# EAGLE design powerCard_rev0.1 (EAGLE 9.4.2)
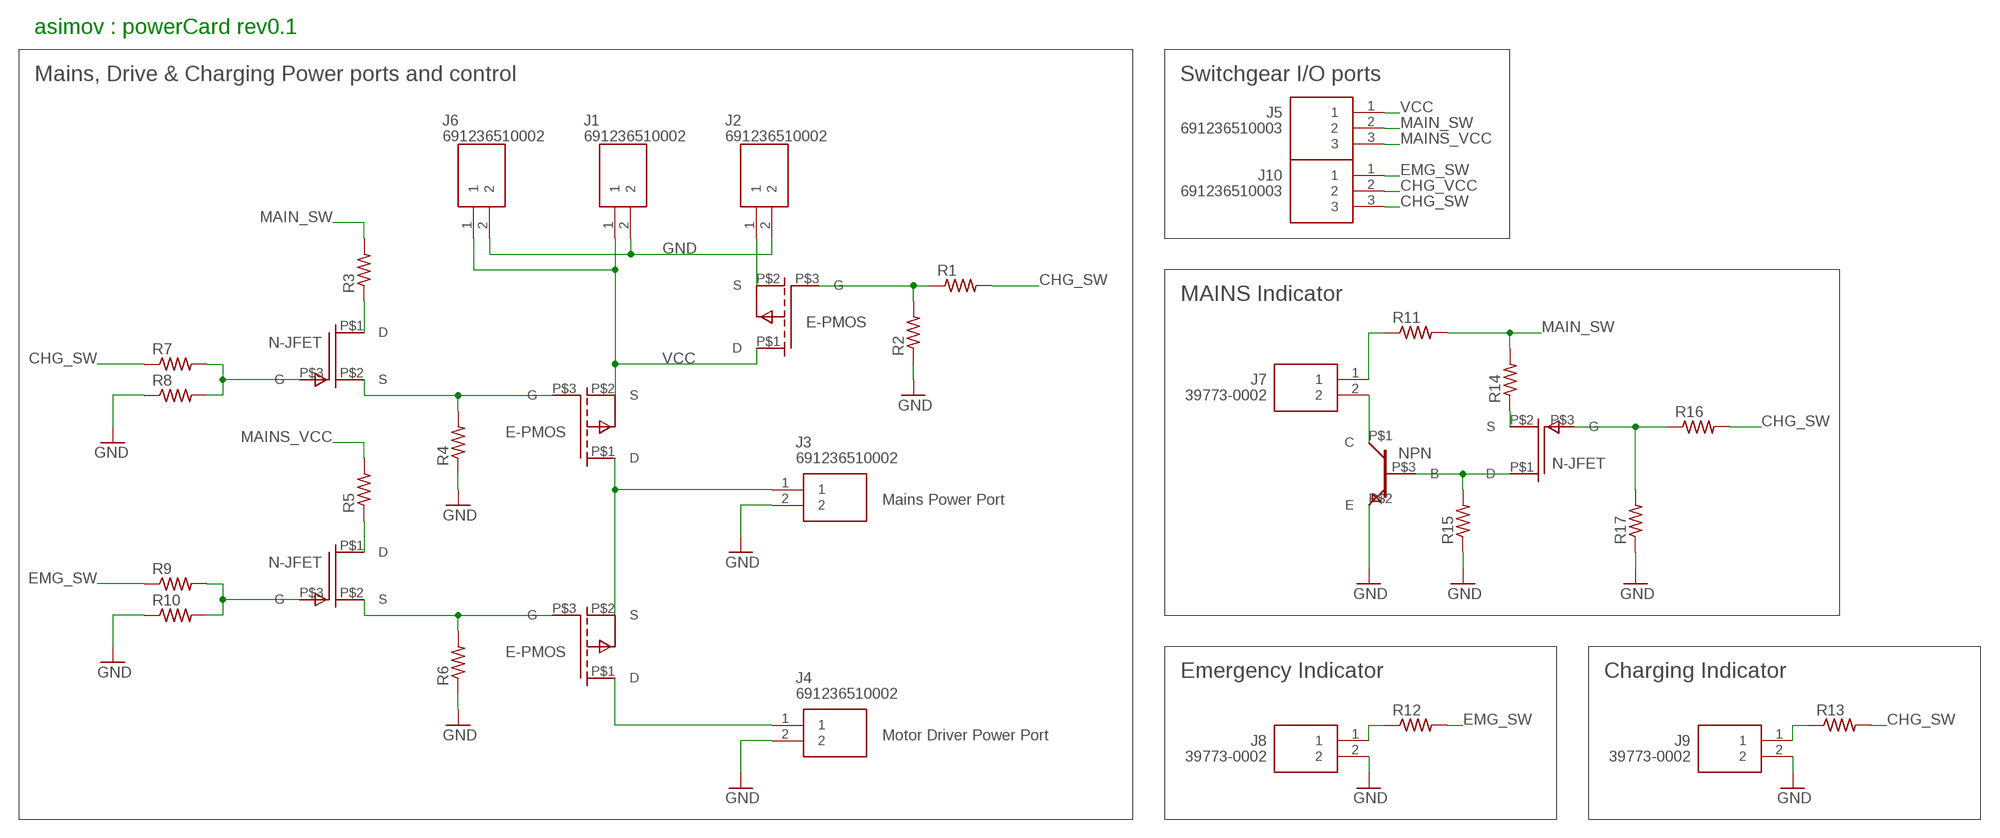
[diagram p0: schematic, sheet 1]

## Parts
J1  691236510002  [SHDR2W90P0X508_1X2_1076X1135X1]
J2  691236510002  [SHDR2W90P0X508_1X2_1076X1135X1]
J3  691236510002  [SHDR2W90P0X508_1X2_1076X1135X1]
J4  691236510002  [SHDR2W90P0X508_1X2_1076X1135X1]
J5  691236510003  [SHDR3W90P0X508_1X3_1524X1135X1]
J6  691236510002  [SHDR2W90P0X508_1X2_1076X1135X1]
J7  39773-0002  [SHDR2W110P0X254_1X2_554X650X10]
J8  39773-0002  [SHDR2W110P0X254_1X2_554X650X10]
J9  39773-0002  [SHDR2W110P0X254_1X2_554X650X10]
J10  691236510003  [SHDR3W90P0X508_1X3_1524X1135X1]
R1  R-US_0204/7  [0204/7]
R2  R-US_0204/7  [0204/7]
R3  R-US_0204/7  [0204/7]
R4  R-US_0204/7  [0204/7]
R5  R-US_0204/7  [0204/7]
R6  R-US_0204/7  [0204/7]
R7  R-US_0204/7  [0204/7]
R8  R-US_0204/7  [0204/7]
R9  R-US_0204/7  [0204/7]
R10  R-US_0204/7  [0204/7]
R11  R-US_0204/7  [0204/7]
R12  R-US_0204/7  [0204/7]
R13  R-US_0204/7  [0204/7]
R14  R-US_0204/7  [0204/7]
R15  R-US_0204/7  [0204/7]
R16  R-US_0204/7  [0204/7]
R17  R-US_0204/7  [0204/7]
U$1  E-PMOSFET  [TO-220]
U$2  E-PMOSFET  [TO-220]
U$3  E-PMOSFET  [TO-220]
U$4  N-JFET  [TO-92(3L)]
U$5  N-JFET  [TO-92(3L)]
U$6  NPN-BJT  [TO-92]
U$7  N-JFET  [TO-92(3L)]

## Nets
CHG_GATE: R1.1 R2.2 U$1.P$3(G)
CHG_SW: J10.3 R1.2 R7.1 R13.2 R16.2
CHG_VCC: J2.1 J10.2 U$1.P$2(S)
EMG_GATE: R6.2 U$3.P$3(G) U$5.P$2(S)
EMG_SW: J10.1 R9.1 R12.2
GND: J1.2 J2.2 J3.2 J4.2 J6.2 J8.2 J9.2 R2.1 R4.1 R6.1 R8.1 R10.1 R15.1 R17.1 U$6.P$2(E)
MAIN_SW: J5.2 R3.2 R11.2 R14.2
MAINS_GATE: R4.2 U$2.P$3(G) U$4.P$2(S)
MAINS_IND_BASE: R15.2 U$6.P$3(B) U$7.P$1(D)
MAINS_IND_GATE: R16.1 R17.2 U$7.P$3(G)
MAINS_VCC: J3.1 J5.3 R5.2 U$2.P$1(D) U$3.P$2(S)
MD_VCC: J4.1 U$3.P$1(D)
N$1: R3.1 U$4.P$1(D)
N$2: R7.2 R8.2 U$4.P$3(G)
N$3: R9.2 R10.2 U$5.P$3(G)
N$4: J7.1 R11.1
N$5: R5.1 U$5.P$1(D)
N$6: J8.1 R12.1
N$7: J9.1 R13.1
N$8: J7.2 U$6.P$1(C)
N$11: R14.1 U$7.P$2(S)
VCC: J1.1 J5.1 J6.1 U$1.P$1(D) U$2.P$2(S)

## Notes on the sheet
- asimov : powerCard rev0.1
- Mains, Drive & Charging Power ports and control | Switchgear I/O ports
- MAINS Indicator
- Mains Power Port
- Emergency Indicator | Charging Indicator
- Motor Driver Power Port

## Library data of the parts
J1-J4 J6 = 691236510002:691236510002: Fixed Terminal Blocks WR-TBL 2365 Hztl 5.08mm Risng clamp Source: Datasheet <https://katalog.we-online.de/en/em/TBL_5_08_2365_HORIZONTAL_ENTRY_W_RISING_CAGE_CLAMP_6912365100xx>; DESCRIPTION: Fixed Terminal Blocks WR-TBL 2365 Hztl 5.08mm Risng clamp; HEIGHT: 18.1mm; MANUFACTURER_NAME: Wurth Elektronik; MANUFACTURER_PART_NUMBER: 691236510002; MOUSER_PART_NUMBER: 710-691236510002; MOUSER_PRICE-STOCK: https://www.mouser.com/Search/Refine.aspx?Keyword=710-691236510002
J5 J10 = 691236510003:691236510003: Fixed Terminal Blocks WR-TBL 2365 Hztl 5.08mm Risng clamp Source: Datasheet <https://katalog.we-online.de/em/datasheet/691236510003.pdf>; DESCRIPTION: Fixed Terminal Blocks WR-TBL 2365 Hztl 5.08mm Risng clamp; HEIGHT: 18.1mm; MANUFACTURER_NAME: Wurth Elektronik; MANUFACTURER_PART_NUMBER: 691236510003; MOUSER_PART_NUMBER: 710-691236510003; MOUSER_PRICE-STOCK: https://www.mouser.com/Search/Refine.aspx?Keyword=710-691236510003
J7-J9 = 39773-0002:39773-0002: Fixed Terminal Blocks 2.54mm Eurostyle Fxd TB Mnt PCB 2Ckt Grn Source: Datasheet <https://www.molex.com/pdm_docs/sd/397730002_sd.pdf>; DESCRIPTION: Fixed Terminal Blocks 2.54mm Eurostyle Fxd TB Mnt PCB 2Ckt Grn; HEIGHT: 10mm; MANUFACTURER_NAME: Molex; MANUFACTURER_PART_NUMBER: 39773-0002; MOUSER_PART_NUMBER: 538-39773-0002; MOUSER_PRICE-STOCK: https://www.mouser.com/Search/Refine.aspx?Keyword=538-39773-0002
R1-R17 = rcl:R-US_: RESISTOR, American symbol; SPICEPREFIX: R
U$1-U$3 = transistors:E-PMOSFET: Enhancement type P-Channel MOSFET > Normally Open. > Apply -VGS to connect.
U$4 U$5 U$7 = transistors:N-JFET: N-Channel JFET > Normally Closed. > Apply -VGS to disconnect.
U$6 = transistors:NPN-BJT: NPN BJT > Normally Open. > Apply +VBE to connect.

## Board
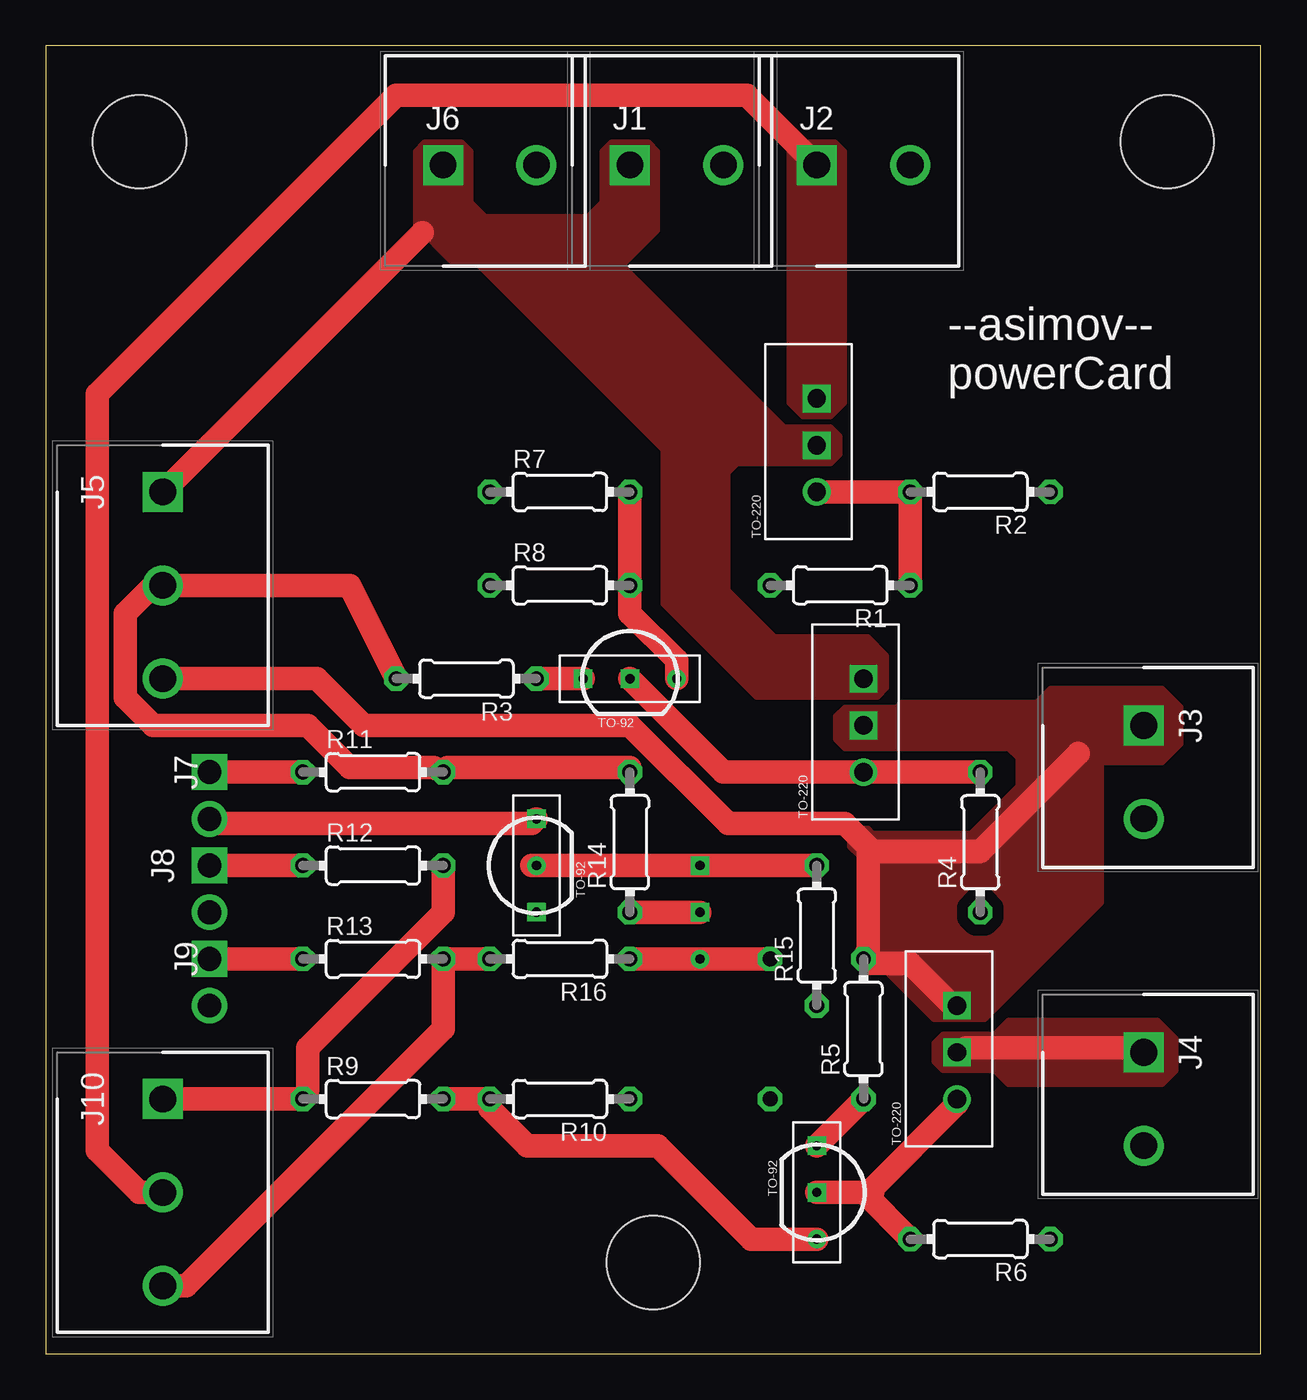
[diagram p1: board, top side]
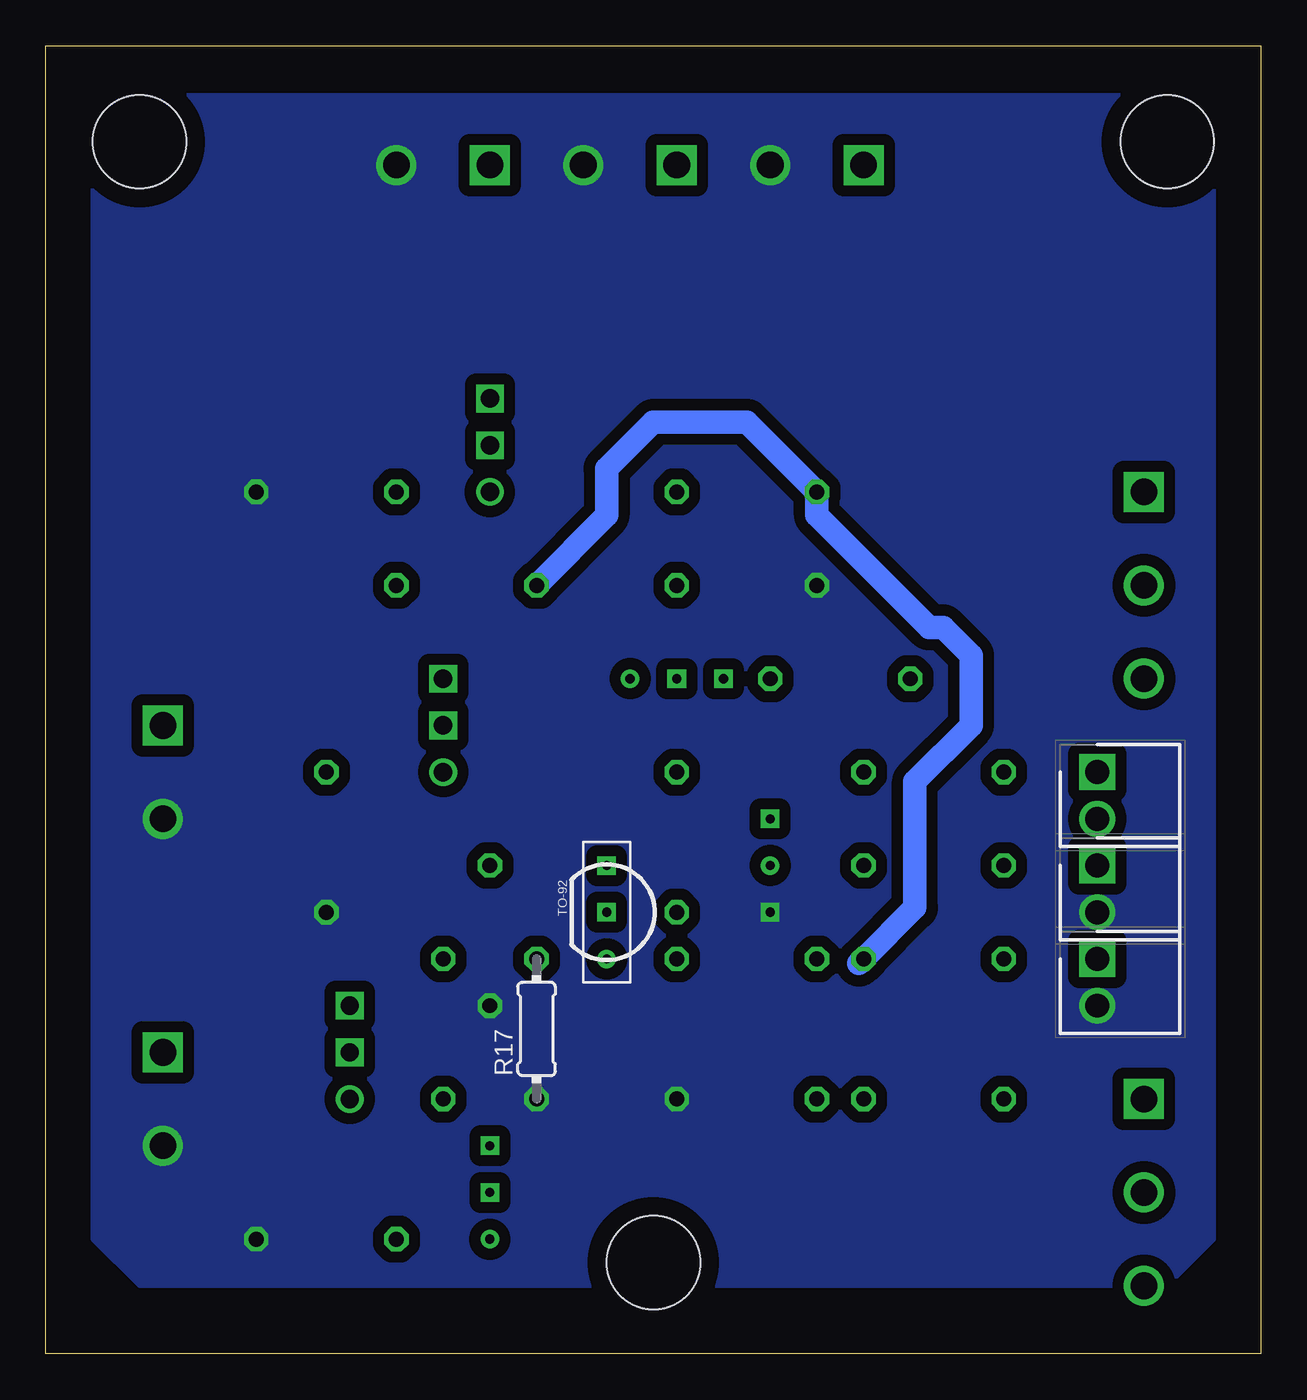
[diagram p2: board, bottom side, seen from below]

Size 66.05 x 71.12 mm. Coordinates in mm from the lower left corner, seen from the top.
Outline: 0,0 66.05,0 66.05,71.12 0,71.12 0,0
Copper layers (1*16): Top 0.035mm / dielectric 1.5mm / Bottom 0.035mm
Design rules "default *": minimum track width 50mil, minimum drill 50mil, track to track 10mil, track to pad 10mil, pad to pad 10mil, via to via 10mil, smd to smd 6mil, copper to edge 40mil, drill to drill 6mil, minimum pad ring 10mil, minimum via ring 8mil, stop-mask expansion 4mil, vias tented up to drill 0mil, thermal gap 10mil
Holes 5.08 mm at 5.08,65.91 60.96,65.91 33.02,4.95

### Footprints (pad centres in the part's own frame; a part is rotated, then mirrored left to right if it is on the bottom)
SHDR2W90P0X508_1X2_1076X1135X1 = drill 1.45 pad 2.175 square: 1 0,0 | drill 1.45 pad 2.175: 2 5.08,0
SHDR3W90P0X508_1X3_1524X1135X1 = drill 1.45 pad 2.175 square: 1 0,0 | drill 1.45 pad 2.175: 2 5.08,0; 3 10.16,0
SHDR2W110P0X254_1X2_554X650X10 = drill 1.3 pad 1.95 square: 1 0,0 | drill 1.3 pad 1.95: 2 2.54,0
0204/7 = drill 0.813 octagon: 1 -3.81,0; 2 3.81,0
TO-220 = drill 1 square: P$1 0,0; P$2 2.54,0 | drill 1: P$3 -2.54,0
TO-92(3L) = drill 0.5 square: P$1 -2.54,0; P$2 0,0 | drill 0.5: P$3 2.54,0
TO-92 = drill 0.5 square: P$1 2.54,0; P$2 -2.54,0 | drill 0.5: P$3 0,0

### Placement (x,y rotation side)
J1  31.75,64.64 0 top
J2  41.91,64.64 0 top
J3  59.69,34.16 270 top
J4  59.69,16.38 270 top
J5  6.35,46.86 270 top
J6  21.59,64.64 0 top
J7  8.89,31.62 270 bottom
J8  8.89,26.54 270 bottom
J9  8.89,21.46 270 bottom
J10  6.35,13.84 270 top
R1  43.18,41.78 180 top
R2  50.8,46.86 180 top
R3  22.86,36.7 180 top
R4  50.8,27.81 90 top
R5  44.45,17.65 90 top
R6  50.8,6.22 180 top
R7  27.94,46.86 0 top
R8  27.94,41.78 0 top
R9  17.78,13.84 0 top
R10  27.94,13.84 180 top
R11  17.78,31.62 0 top
R12  17.78,26.54 0 top
R13  17.78,21.46 0 top
R14  31.75,27.81 90 top
R15  41.91,22.73 90 top
R16  27.94,21.46 180 top
R17  39.37,17.65 90 bottom
U$1  41.91,49.4 90 top
U$2  44.45,34.16 90 top
U$3  49.53,16.38 90 top
U$4  31.75,36.7 0 top
U$5  41.91,8.76 270 top
U$6  26.67,26.54 90 top
U$7  35.56,24 270 bottom

### Tracks (layer width: path | path; a pad name or v marks a point on that pad's centre or on a via)
CHG_GATE
  Top 1.27: R1.1 R2.2 U$1.P$3
CHG_SW
  Top 1.27: R16.2 R13.2 21.59,17.65 7.62,3.68 J10.3
  Bottom 1.27: 21.84,21.21 R13.2 18.8,24.26 18.8,31.12 15.75,34.16 15.75,37.97 17.27,39.5 18.03,39.5 24.13,45.59 R7.1 27.94,50.67 33.02,50.67 35.56,48.13 35.56,45.59 R1.2
CHG_VCC
  Top 1.27: J10.2 5.08,8.76 2.79,11.05 2.79,52.2 19.05,68.45 38.1,68.45 J2.1
  pour Top (no thermals): 40.39,65.41 40.89,65.91 42.93,65.91 43.43,65.41 43.43,51.69 42.67,50.93 41.15,50.93 40.39,51.69
EMG_GATE
  Top 1.27: 44.45,8.76 44.96,8.76 44.83,8.89 49.53,13.59 U$3.P$3 | 44.45,8.76 U$5.P$2 | R6.2 44.45,8.76
EMG_SW
  Top 1.27: J10.1 R9.1 14.22,14.35 14.22,16.64 21.59,24 R12.2
GND
  pour Bottom (isolate 0.61, no thermals): 5.08,68.45 2.54,65.91 2.54,64.64 2.54,6.22 5.08,3.68 60.96,3.68 63.5,6.22 63.5,65.91 60.96,68.45
MAIN_SW
  Top 1.27: R14.2 31.75,31.88 21.84,31.88 R11.2 21.08,31.88 16.51,31.88 14.22,34.16 5.84,34.16 4.32,35.69 4.32,40.26 5.84,41.78 J5.2 16.51,41.78 R3.2
MAINS_GATE
  Top 1.27: U$4.P$2 36.83,31.62 U$2.P$3 R4.2
MAINS_IND_BASE
  Top 1.27: 26.42,26.54 U$6.P$3 U$7.P$1 R15.2
MAINS_IND_GATE
  Top 1.27: R16.1 U$7.P$3 R17.2
MAINS_VCC
  Top 1.27: U$3.P$2 49.28,18.92 46.99,21.21 44.7,21.21 R5.2 44.7,21.97 44.7,27.3 44.96,27.3 | J5.3 14.73,36.7 17.27,34.16 31.75,34.16 37.08,28.83 43.43,28.83 44.96,27.3 | 56.13,32.64 50.8,27.3 44.96,27.3
  pour Top (no thermals): 46.23,35.18 43.43,35.18 42.93,34.67 42.93,33.4 43.43,32.89 53.85,32.89 54.61,32.13 60.71,32.13 61.72,33.15 61.72,35.18 60.71,36.2 56.13,36.2 54.61,36.2 53.85,35.43 46.48,35.43
  pour Top (isolate 0.61, no thermals): 48.26,18.16 51.05,18.16 57.4,24.51 57.4,32.13 54.61,32.13 53.85,32.89 52.32,32.89 52.83,32.38 52.83,30.86 50.29,28.32 44.96,28.32 44.7,28.58 44.2,28.58 43.69,28.07 43.69,27.56 44.2,27.05 44.2,22.23
MD_VCC
  Top 1.27: U$3.P$1 50.04,16.64 59.18,16.64 J4.1
  pour Top (no thermals): 49.53,17.4 48.77,17.4 48.51,17.15 48.26,16.89 48.26,15.88 48.77,15.37 51.56,15.37 52.32,14.61 60.71,14.61 61.47,15.37 61.47,17.15 60.45,18.16 52.32,18.16 51.56,17.4
N$1
  Top 1.27: R3.1 U$4.P$1
N$2
  Top 1.27: U$4.P$3 34.29,37.72 31.75,40.26 R8.2 R7.2
N$3
  Top 1.27: U$5.P$3 38.35,6.22 33.27,11.3 26.16,11.3 24.13,13.34 R10.2 R9.2
N$4
  Top 1.27: J7.1 R11.1
N$5
  Top 1.27: R5.1 U$5.P$1
N$6
  Top 1.27: J8.1 R12.1
N$7
  Top 1.27: J9.1 R13.1
N$8
  Top 1.27: U$6.P$1 26.42,28.83 8.89,28.83 J7.2
N$11
  Top 1.27: R14.1 U$7.P$2
VCC
  Top 1.27: 20.45,60.96 J5.1
  pour Top (no thermals): 23.11,65.41 22.61,65.91 20.57,65.91 20.07,65.41 20.07,61.34 22.1,59.31 31.5,59.31 33.27,61.09 33.27,65.41 32.77,65.91 30.73,65.91 30.23,65.41 30.23,62.61 29.46,61.85 26.67,61.85 23.88,61.85 23.11,62.61
  pour Top (no thermals): 38.61,35.69 45.21,35.69 45.72,36.2 45.72,37.97 44.7,38.99 39.62,38.99 37.08,41.53 37.08,47.88 37.59,48.39 42.67,48.39 43.18,48.89 43.18,49.91 42.67,50.42 40.13,50.42 31.24,59.31 23.37,59.31 33.53,49.15 33.53,40.77

### Text on the board
tNames: --asimov-- / powerCard